# EAGLE design due-adaptor-sanguinololu-end (EAGLE 6.4)
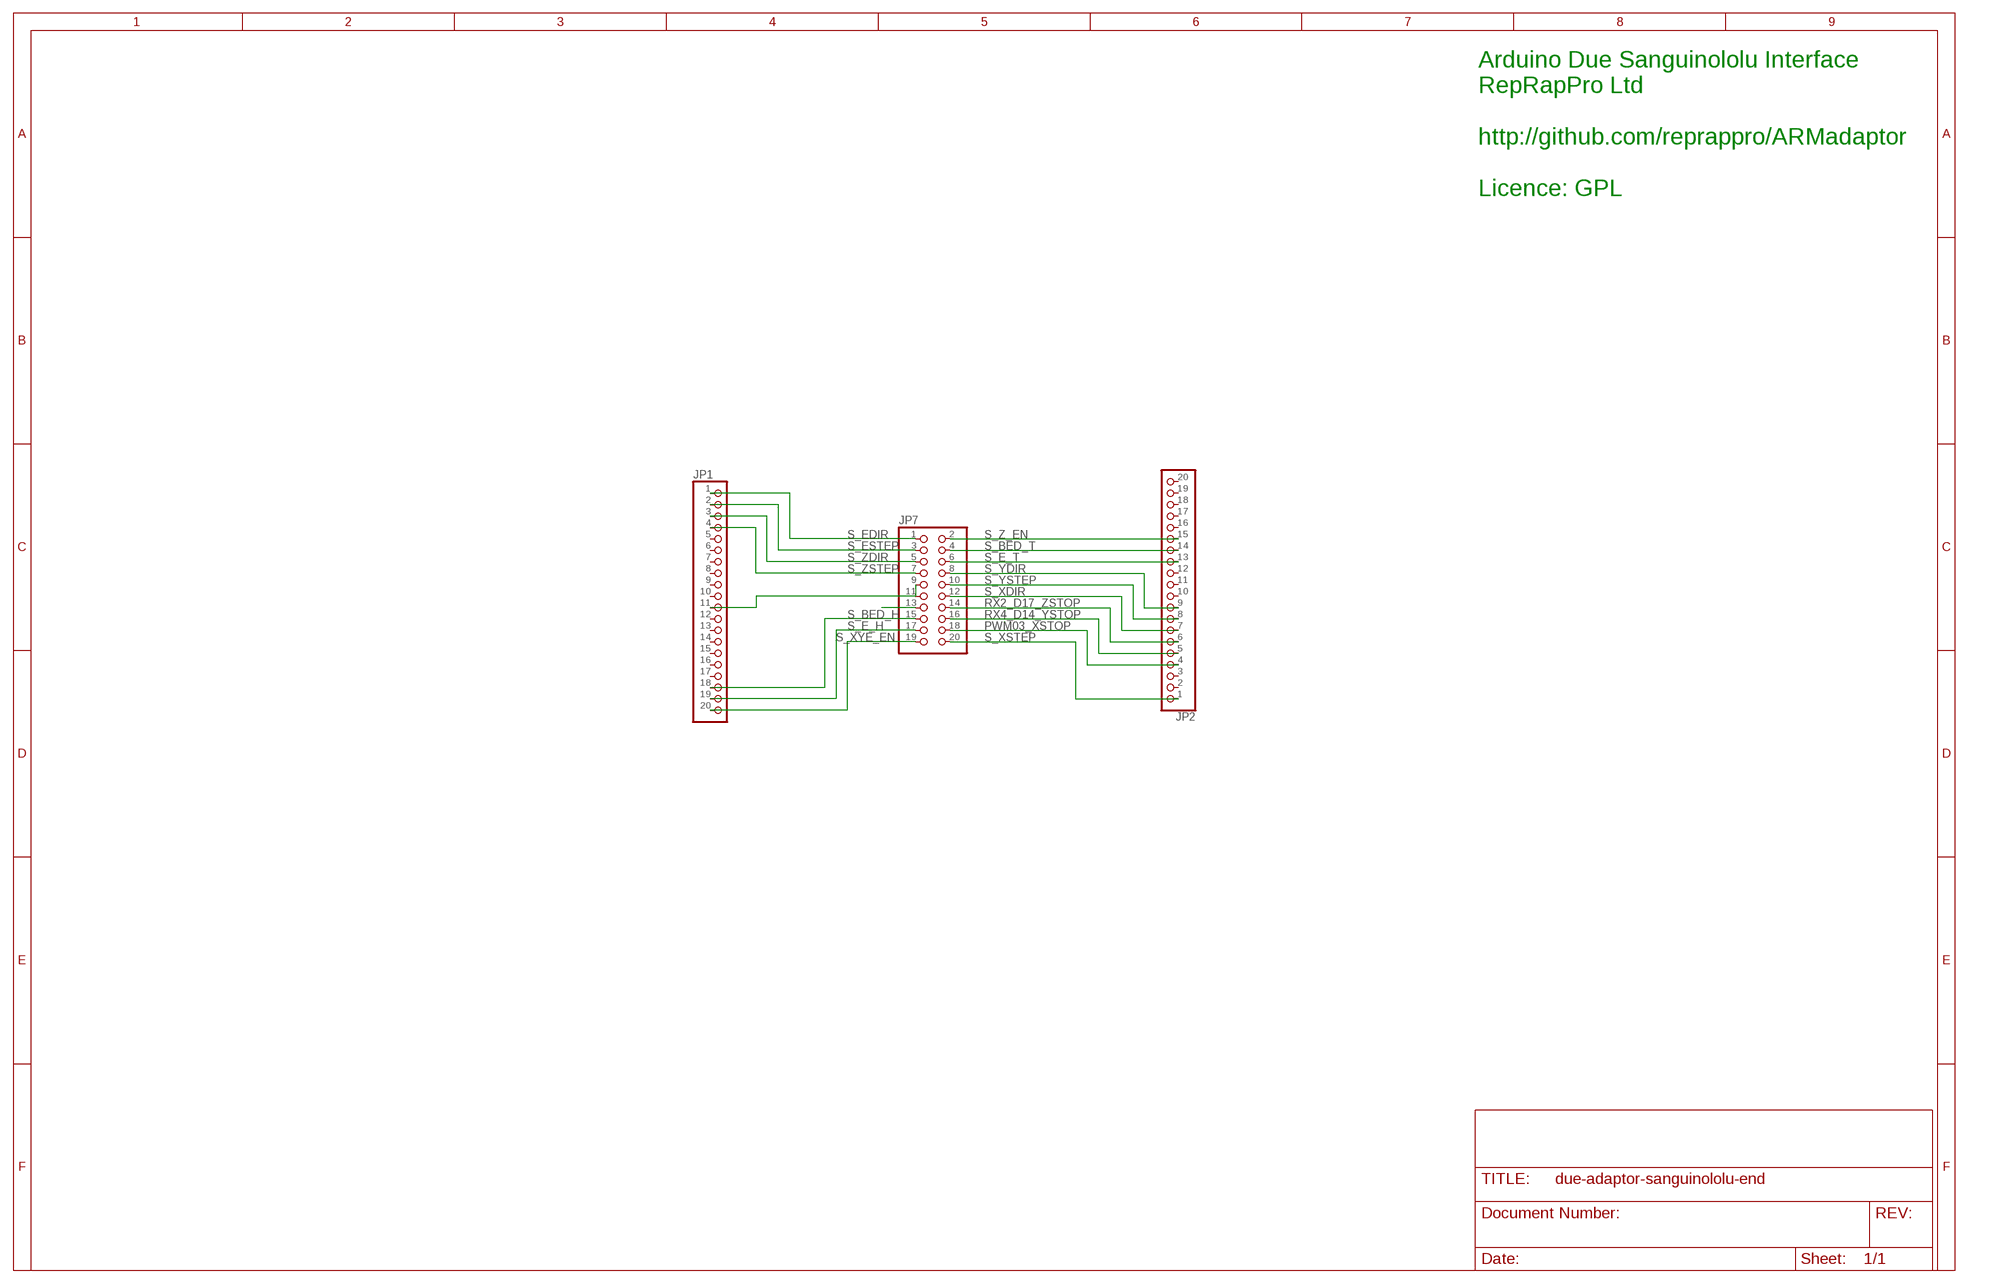
[diagram p0: schematic, sheet 1]

## Parts
JP1  PINHD-1X20  [1X20]
JP2  PINHD-1X20  [1X20]
JP7  PINHD-2X10  [2X10]

## Nets
N$1 [gnd]: JP1.11 JP7.9 JP7.11
N$7: JP7.13
PWM03_XSTOP: JP2.4 JP7.18
RX2_D17_ZSTOP: JP2.6 JP7.14
RX4_D14_YSTOP: JP2.5 JP7.16
S_BED_H: JP1.18 JP7.15
S_BED_T: JP2.14 JP7.4
S_E_H: JP1.19 JP7.17
S_E_T: JP2.13 JP7.6
S_EDIR: JP1.1 JP7.1
S_ESTEP: JP1.2 JP7.3
S_XDIR: JP2.7 JP7.12
S_XSTEP: JP2.1 JP7.20
S_XYE_EN: JP1.20 JP7.19
S_YDIR: JP2.9 JP7.8
S_YSTEP: JP2.8 JP7.10
S_Z_EN: JP2.15 JP7.2
S_ZDIR: JP1.3 JP7.5
S_ZSTEP: JP1.4 JP7.7
Unconnected: JP1.5 JP1.6 JP1.7 JP1.8 JP1.9 JP1.10 JP1.12 JP1.13 JP1.14 JP1.15 JP1.16 JP1.17 JP2.2 JP2.3 JP2.10 JP2.11 JP2.12 JP2.16 JP2.17 JP2.18 JP2.19 JP2.20

## Notes on the sheet
- Arduino Due Sanguinololu Interface
  RepRapPro Ltd
  
  http://github.com/reprappro/ARMadaptor
  
  Licence: GPL

## Library data of the parts
JP1 JP2 = pinhead:PINHD-1X20: PIN HEADER
JP7 = pinhead:PINHD-2X10: PIN HEADER

## Net classes
0 default: width 0.203 mm, drill 0.406 mm, clearance 0.203 mm
1 power: width 0.61 mm, drill 0.711 mm, clearance 0.203 mm
2 gnd: width 0.305 mm, drill 0.711 mm, clearance 0.203 mm
3 usbvcc: width 0.508 mm, drill 0.711 mm, clearance 0.203 mm

## Board
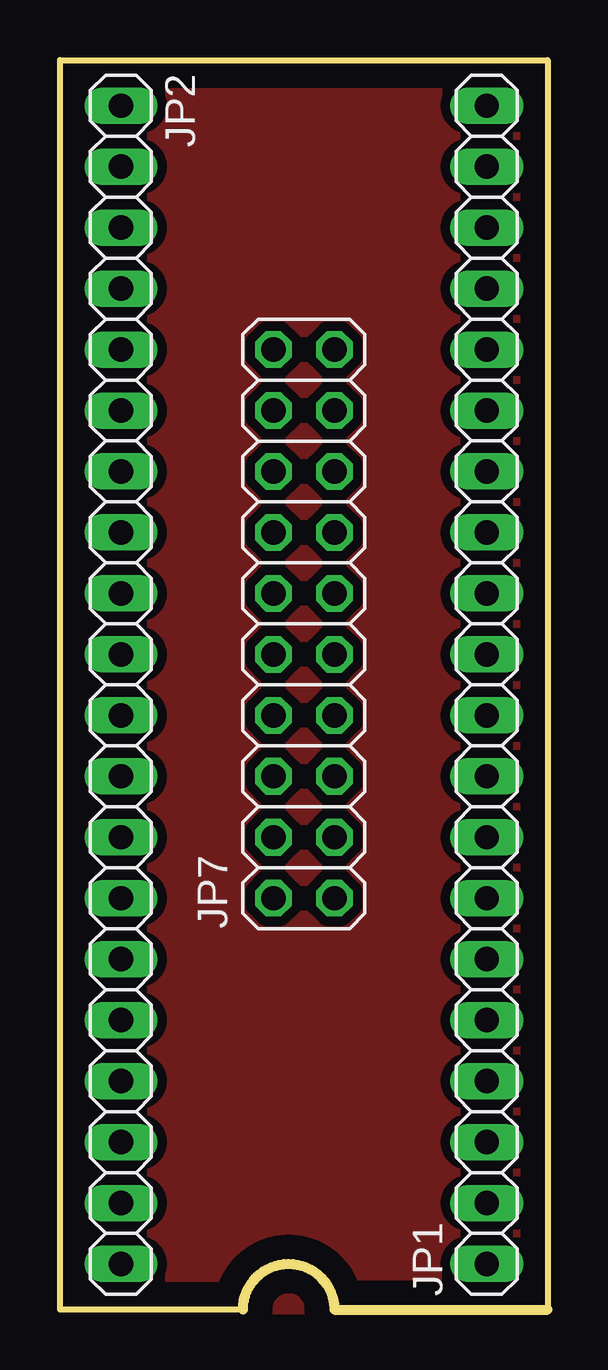
[diagram p1: board, top side]
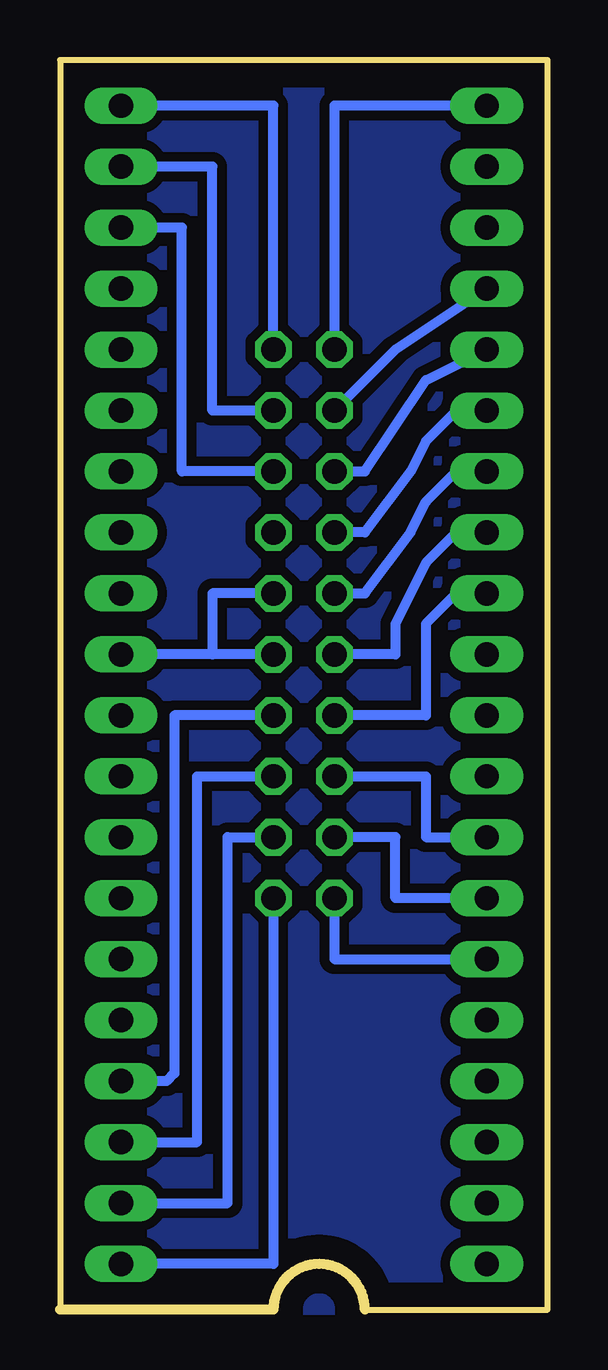
[diagram p2: board, bottom side, seen from below]

Size 20.32 x 52.07 mm. Coordinates in mm from the lower left corner, seen from the top.
Outline: 7.62,0 0,0 0,52.07 20.32,52.07 20.32,0 11.43,0 arc180 7.62,0
Copper layers (1*16): Top 0.035mm / dielectric 1.5mm / Bottom 0.035mm
Design rules "default *": minimum track width 16mil, minimum drill 32mil, track to track 16mil, track to pad 16mil, pad to pad 16mil, via to via 16mil, smd to smd 16mil, copper to edge 40mil, drill to drill 20mil, minimum pad ring 10mil, minimum via ring 10mil, stop-mask expansion 4mil, vias tented up to drill 0mil, thermal gap 10mil

### Footprints (pad centres in the part's own frame; a part is rotated, then mirrored left to right if it is on the bottom)
1X20 = drill 1.016 long: 1 -24.13,0; 2 -21.59,0; 3 -19.05,0; 4 -16.51,0; 5 -13.97,0; 6 -11.43,0; 7 -8.89,0; 8 -6.35,0; 9 -3.81,0; 10 -1.27,0; 11 1.27,0; 12 3.81,0; 13 6.35,0; 14 8.89,0; 15 11.43,0; 16 13.97,0; 17 16.51,0; 18 19.05,0; 19 21.59,0; 20 24.13,0
2X10 = drill 1.016 octagon: 1 -11.43,-1.27; 2 -11.43,1.27; 3 -8.89,-1.27; 4 -8.89,1.27; 5 -6.35,-1.27; 6 -6.35,1.27; 7 -3.81,-1.27; 8 -3.81,1.27; 9 -1.27,-1.27; 10 -1.27,1.27; 11 1.27,-1.27; 12 1.27,1.27; 13 3.81,-1.27; 14 3.81,1.27; 15 6.35,-1.27; 16 6.35,1.27; 17 8.89,-1.27; 18 8.89,1.27; 19 11.43,-1.27; 20 11.43,1.27

### Placement (x,y rotation side)
JP1  17.78,26.04 90 top
JP2  2.54,26.04 270 top
JP7  10.16,28.57 90 top

### Tracks (layer width: path | path; a pad name or v marks a point on that pad's centre or on a via)
GND
  pour Bottom: 0,52.07 20.32,52.07 20.32,0 0,0
  pour Top: 0,52.07 20.32,52.07 20.32,0 0,0
N$1
  Bottom 0.406: JP7.11 13.97,29.85 13.97,27.3 | 13.97,27.3 JP1.11 | JP7.9 13.97,27.3
PWM03_XSTOP
  Bottom 0.406: JP2.4 6.35,40.01 JP7.18
RX2_D17_ZSTOP
  Bottom 0.406: JP2.6 3.81,37.47 5.08,36.2 5.72,34.93 7.62,32.39 JP7.14
RX4_D14_YSTOP
  Bottom 0.406: JP7.16 7.62,34.93 5.08,38.73 JP2.5
S_BED_H
  Bottom 0.406: JP7.15 15.24,34.93 15.24,45.09 JP1.18
S_BED_T
  Bottom 0.406: JP2.14 6.35,17.14 6.35,19.68 JP7.4
S_E_H
  Bottom 0.406: JP7.17 13.97,37.47 13.97,47.62 JP1.19
S_E_T
  Bottom 0.406: JP7.6 5.08,22.22 5.08,19.68 JP2.13
S_EDIR
  Bottom 0.406: JP7.1 11.43,1.91 JP1.1
S_ESTEP
  Bottom 0.406: JP1.2 13.34,4.45 13.34,19.68 JP7.3
S_XDIR
  Bottom 0.406: JP7.12 7.62,29.85 5.72,32.39 5.08,33.66 3.81,34.93 JP2.7
S_XSTEP
  Bottom 0.406: JP2.1 8.89,50.17 JP7.20
S_XYE_EN
  Bottom 0.406: JP7.19 11.43,50.17 JP1.20
S_YDIR
  Bottom 0.406: JP2.9 3.81,29.85 5.08,28.57 5.08,24.77 JP7.8
S_YSTEP
  Bottom 0.406: JP2.8 3.81,32.39 5.08,31.11 6.35,28.57 6.35,27.3 JP7.10
S_Z_EN
  Bottom 0.406: JP7.2 8.89,14.61 JP2.15
S_ZDIR
  Bottom 0.406: JP1.3 14.61,6.99 14.61,22.22 JP7.5
S_ZSTEP
  Bottom 0.406: JP7.7 15.56,24.77 15.56,9.84 15.88,9.52 JP1.4